# Altium schematic sheet half_bridge.SchDoc
size 381 x 241 mm
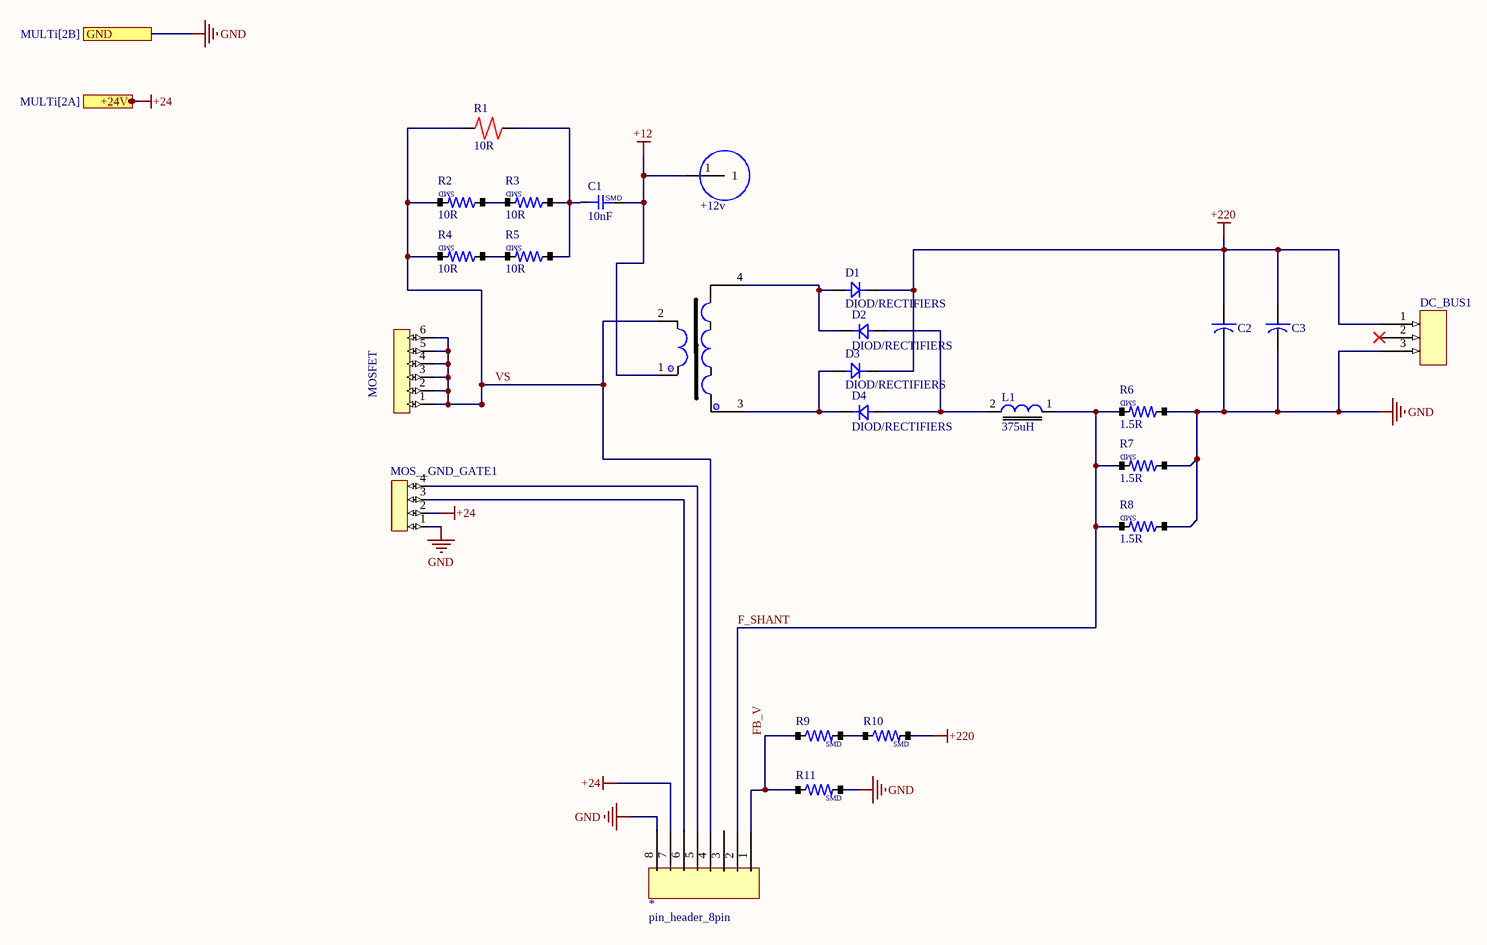
[diagram p0: half_bridge.SchDoc]

## Parts
*  pin_header_8pin  [pin_header8]
*1  TRANS-FT8350C  [EI 3329D]  (value not drawn)
+12v  PIN1  [PIN1]  (value not drawn)
C1  10nF  [CAP-1206]
C2  33uF  [CAP-EL_P5MM]  (value not drawn)
C3  33uF  [CAP-EL_P5MM]  (value not drawn)
D1  DIOD/RECTIFIERS  [1N4508_REZA]
D2  DIOD/RECTIFIERS  [1N4508_REZA]
D3  DIOD/RECTIFIERS  [1N4508_REZA]
D4  DIOD/RECTIFIERS  [1N4508_REZA]
DC_BUS1  (no value)  [CONECTOR/FONIX/3PIN]
L1  375uH  [EI-28-SELF_DC]
MOS__GND_GATE1  CONECTOR/XH/4PIN  [CONECTOR/XH/4PIN]  (value not drawn)
MOSFET  (no value)  [pin_header_6pin]
R1  10R  [RES/0.25W]
R2  10R  [RES/1206]
R3  10R  [RES/1206]
R4  10R  [RES/1206]
R5  10R  [RES/1206]
R6  1.5R  [RES/1206]
R7  1.5R  [RES/1206]
R8  1.5R  [RES/1206]
R9  r  [RES/1206]  (value not drawn)
R10  r  [RES/1206]  (value not drawn)
R11  r  [RES/1206]  (value not drawn)

## Ports
+24V (see MULTi[2A]), GND (see MULTi[2B])

## Nets
+12: *1.1 +12v.1 C1.2
+24: *.7 MOS__GND_GATE1.2 ; port +24V
+220: C2.+ C3.+ D1.K D3.K DC_BUS1.1 R10.2
GND: *.8 C2.- C3.- DC_BUS1.3 MOS__GND_GATE1.1 R6.1 R7.1 R8.1 R11.2 ; port GND
F_SHANT: *.2 L1.1 R6.2 R7.2 R8.2
FB_V: *.1 R9.1 R11.1
VS: *.4 *1.2 MOSFET.1 MOSFET.2 MOSFET.3 MOSFET.4 MOSFET.5 MOSFET.6 R1.1 R2.2 R4.2
Net*1_3: *1.3 D3.A D4.K
Net*1_4: *1.4 D1.A D2.K
Net*_5: *.5 MOS__GND_GATE1.4
Net*_6: *.6 MOS__GND_GATE1.3
NetC1_1: C1.1 R1.2 R3.1 R5.1
NetD2_A: D2.A D4.A L1.2
NetR2_1: R2.1 R3.2
NetR4_1: R4.1 R5.2
NetR9_2: R9.2 R10.1

Not connected (* = marked no-connect by the designer): * 3; DC_BUS1 2*

## Notes on the sheet
- (in symbol cap_smd) SMD
- (in symbol RES/SMD) SMD

## Library data of the parts
C1 = cap_smd
C2 C3 = cap-electrolit
DC_BUS1 = CONECTOR/FONIX/3PIN: SYSTEM: CONNECTOR
L1 = inductor
MOSFET = PIN_HEADER6
R1 = RES/<1W
R2-R11 = RES/SMD